# EAGLE design ardusb (EAGLE 6.4)
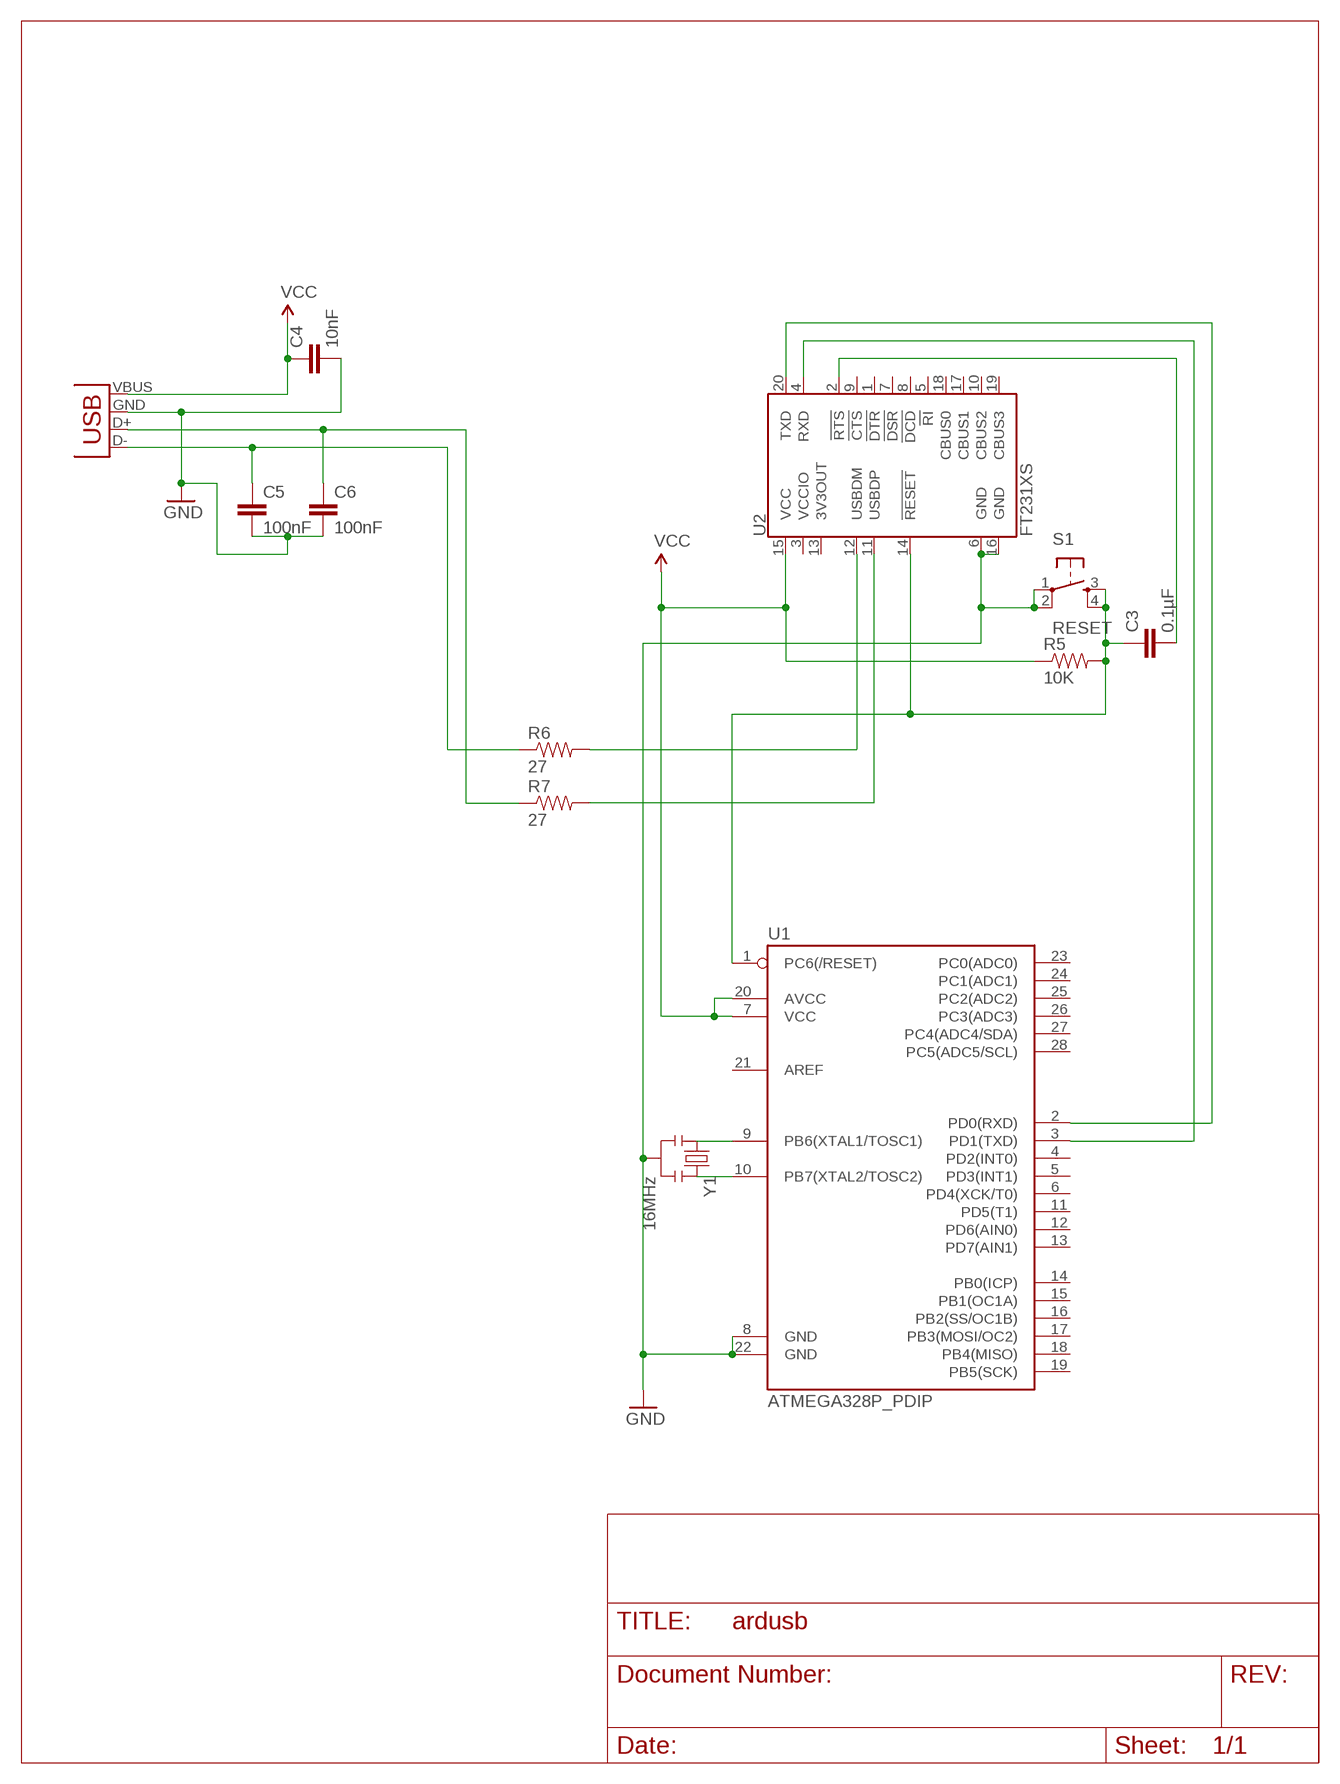
[diagram p0: schematic, sheet 1]

## Parts
C3  0.1µF  CAPPTH  [CAP-PTH-SMALL]
C4  10nF  CAPPTH  [CAP-PTH-SMALL]
C5  100nF  CAPPTH  [CAP-PTH-SMALL]
C6  100nF  CAPPTH  [CAP-PTH-SMALL]
JP1  USB-A-H  [USB-A-H]
R5  10K  RESISTORPTH-1W  [AXIAL-0.6]
R6  27  RESISTORPTH-1W  [AXIAL-0.6]
R7  27  RESISTORPTH-1W  [AXIAL-0.6]
S1  RESET  TAC_SWITCHPTH  [TACTILE-PTH]
U1  ATMEGA328P_PDIP  [DIL28-3]
U2  FT231XS  [SSOP20_L]
Y1  16MHz  RESONATORPTH  [RESONATOR-PTH]

## Nets
GND: C4.2 C5.2 C6.2 JP1.GND(VBUS) S1.1 S1.2 U1.8(GND) U1.22(GND) U2.6(GND) U2.16(GND) Y1.2
N$1: U1.9(PB6(XTAL1/TOSC1)) Y1.1
N$2: U1.10(PB7(XTAL2/TOSC2)) Y1.3
N$5: C3.1 R5.P$2 S1.3 S1.4 U1.1(PC6(/RESET)) U2.14(!RESET)
N$6: C3.2 U2.2(!RTS)
N$9: R6.P$2 U2.12(USBDM)
N$10: R7.P$2 U2.11(USBDP)
N$11: U1.3(PD1(TXD)) U2.4(RXD)
N$12: U1.2(PD0(RXD)) U2.20(TXD)
N$13: C6.1 JP1.D+(D-) R7.P$1
N$14: C5.1 JP1.D-(D+) R6.P$1
VCC: C4.1 JP1.VBUS(GND) R5.P$1 U1.7(VCC) U1.20(AVCC) U2.15(VCC)
Unconnected: U1.4(PD2(INT0)) U1.5(PD3(INT1)) U1.6(PD4(XCK/T0)) U1.11(PD5(T1)) U1.12(PD6(AIN0)) U1.13(PD7(AIN1)) U1.14(PB0(ICP)) U1.15(PB1(OC1A)) U1.16(PB2(SS/OC1B)) U1.17(PB3(MOSI/OC2)) U1.18(PB4(MISO)) U1.19(PB5(SCK)) U1.21(AREF) U1.23(PC0(ADC0)) U1.24(PC1(ADC1)) U1.25(PC2(ADC2)) U1.26(PC3(ADC3)) U1.27(PC4(ADC4/SDA)) U1.28(PC5(ADC5/SCL)) U2.1(!DTR) U2.3(VCCIO) U2.5(!RI) U2.7(!DSR) U2.8(!DCD) U2.9(!CTS) U2.10(CBUS2) U2.13(3V3OUT) U2.17(CBUS1) U2.18(CBUS0) U2.19(CBUS3)

## Library data of the parts
C3 C4 = SparkFun-Passives:CAP: Capacitor Standard 0603 ceramic capacitor, and 0.1" leaded capacitor.
C5 C6 = SparkFun-Capacitors:CAP: Capacitor Standard 0603 ceramic capacitor, and 0.1" leaded capacitor.
JP1 = SparkFun-Connectors:USB: USB Connectors USB-B-PTH is fully proven SKU : PRT-00139/CONN-08278 USB-miniB is fully proven SKU : PRT-00587 USB-A-PCB is untested. USB-A-H is throughly reviewed, but untested. Spark Fun Electronics SKU : PRT-00437 USB-B-SMT is throughly reviewed, but untested. Needs silkscreen touching up. USB-A-S has not been used/tested USB-MB-H has not been used/tested USB-MICROB has been used. CONN-09505
R5-R7 = SparkFun-Passives:RESISTOR: Resistor Basic schematic elements and footprints for 0603, 1206, and PTH resistors.
S1 = SparkFun-Electromechanical:TAC_SWITCH: Momentary Switch Button commonly used for reset or general input. Spark Fun Electronics SKU : COM-00097 SMT- SWCH-08247
U1 = SparkFun-DigitalIC:ATMEGA328P_PDIP: uC used in the Arduino 32kb flash, 1k EEPROM, 2k SRAM This is the through-hole version of this chip.
U2 = SparkFun-DigitalIC:FT231X: FTDI FT231X Full Speed USB to Full-handshake UART This USB2.0 Full Speed IC offers a compact bridge to full handshake UART interfaces. The device is a UART, capable of operating up to 3MBaud, with low power consumption (8mA). The FT231X includes the complete FT-X series feature set and enables USB to be added into a system design quickly and easily over a UART interface.
Y1 = SparkFun-FreqCtrl:RESONATOR: Resonator Small SMD resonator. Used, eg, on the Arduino Pro/ Pro Mini boards. 8MHz- XTAL-08895 16MHz- XTAL-08900

## Board
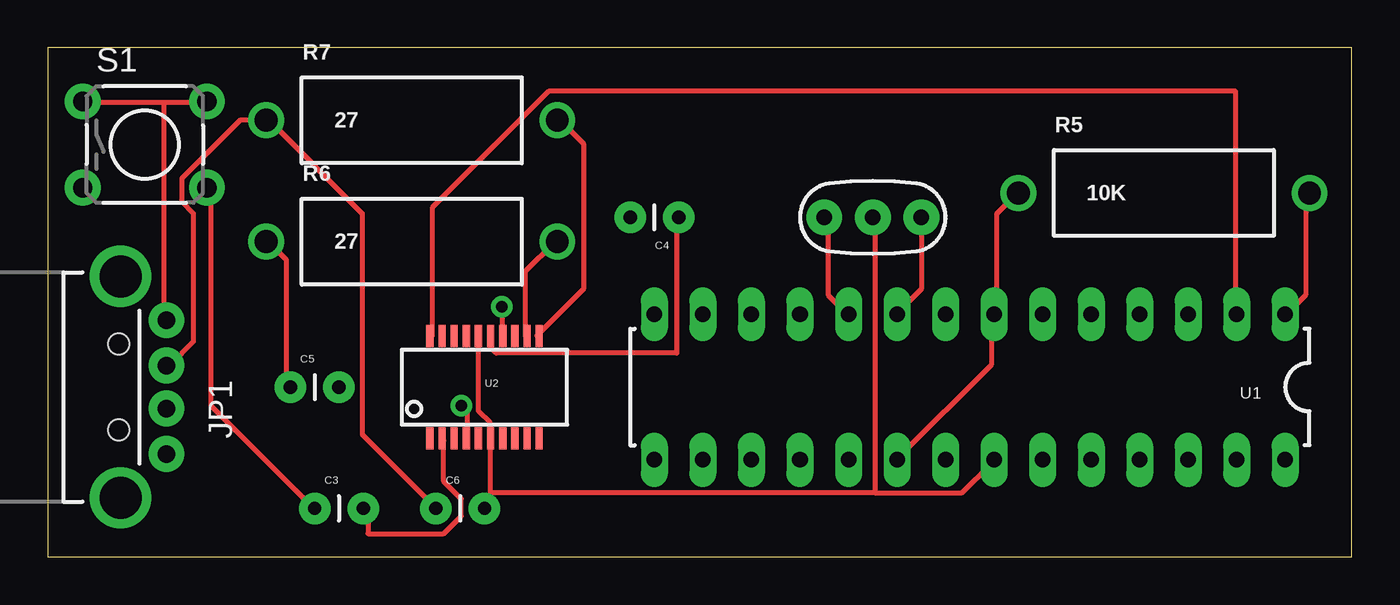
[diagram p1: board, top side]
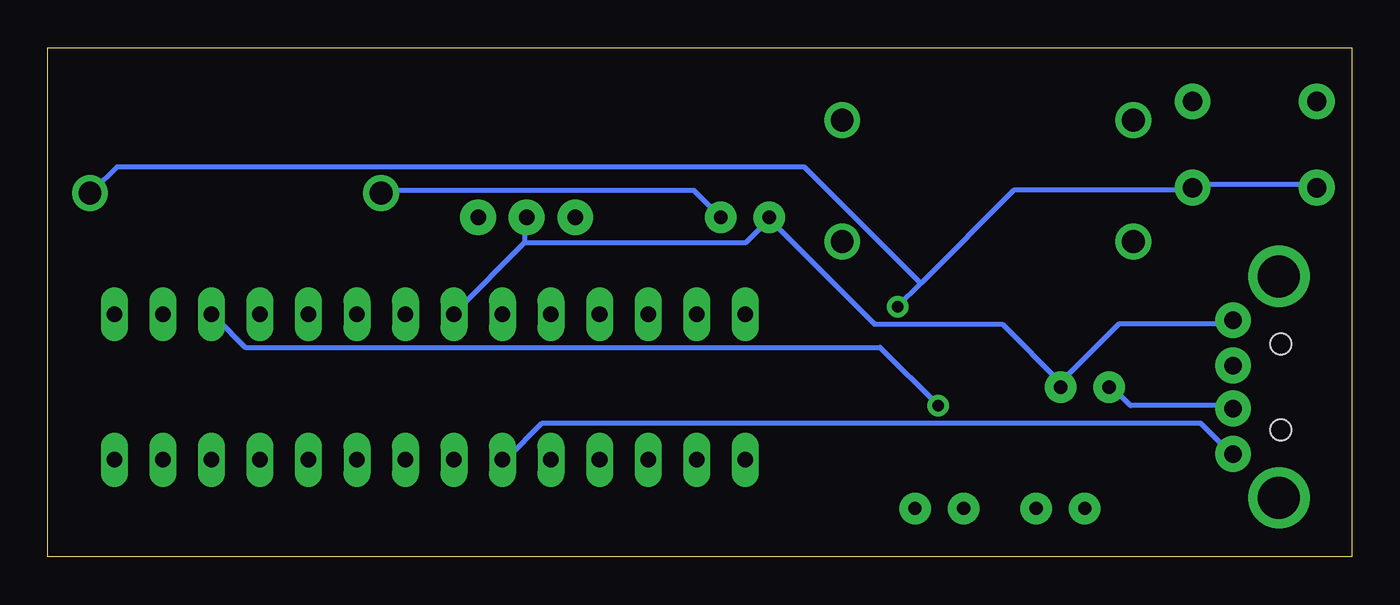
[diagram p2: board, bottom side, seen from below]

Size 68.25 x 26.66 mm. Coordinates in mm from the lower left corner, seen from the top.
Outline: 0,0 68.25,0 68.25,26.66 0,26.66 0,0
Copper layers (1*16): Top 0.035mm / dielectric 1.5mm / Bottom 0.035mm
Design rules "SparkFun": minimum track width 8mil, minimum drill 20mil, track to track 8mil, track to pad 8mil, pad to pad 8mil, via to via 8mil, smd to smd 8mil, copper to edge 10mil, drill to drill 8mil, minimum pad ring 12mil, minimum via ring 10mil, stop-mask expansion 4mil, vias tented up to drill 25mil, thermal gap 10mil

### Footprints (pad centres in the part's own frame; a part is rotated, then mirrored left to right if it is on the bottom)
CAP-PTH-SMALL = drill 0.7 pad 1.651: 1 0,0; 2 2.54,0
USB-A-H = drill 0.914 pad 1.88: D+ 2.4,1.127; D- 2.4,-1.127; GND 2.4,3.5; VBUS 2.4,-3.5 | drill 2.2: GND2 0,-5.8; GND3 0,5.8 | hole 1.1: -0.1,2.25; -0.1,-2.25
AXIAL-0.6 = drill 1.2 pad 1.88: P$1 -7.62,0; P$2 7.62,0
TACTILE-PTH = drill 1.016 pad 1.88: 1 -3.251,2.261; 2 3.251,2.261; 3 -3.251,-2.261; 4 3.251,-2.261
DIL28-3 = drill 0.813 long: 1 -16.51,-3.81; 2 -13.97,-3.81; 3 -11.43,-3.81; 4 -8.89,-3.81; 5 -6.35,-3.81; 6 -3.81,-3.81; 7 -1.27,-3.81; 8 1.27,-3.81; 9 3.81,-3.81; 10 6.35,-3.81; 11 8.89,-3.81; 12 11.43,-3.81; 13 13.97,-3.81; 14 16.51,-3.81; 15 16.51,3.81; 16 13.97,3.81; 17 11.43,3.81; 18 8.89,3.81; 19 6.35,3.81; 20 3.81,3.81; 21 1.27,3.81; 22 -1.27,3.81; 23 -3.81,3.81; 24 -6.35,3.81; 25 -8.89,3.81; 26 -11.43,3.81; 27 -13.97,3.81; 28 -16.51,3.81
SSOP20_L = smd 0.381 x 1.143: 1 -2.857,-2.68; 2 -2.223,-2.68; 3 -1.587,-2.68; 4 -0.953,-2.68; 5 -0.318,-2.68; 6 0.318,-2.68; 7 0.953,-2.68; 8 1.587,-2.68; 9 2.223,-2.68; 10 2.857,-2.68; 11 2.857,2.68; 12 2.223,2.68; 13 1.587,2.68; 14 0.953,2.68; 15 0.318,2.68; 16 -0.318,2.68; 17 -0.953,2.68; 18 -1.587,2.68; 19 -2.223,2.68; 20 -2.857,2.68
RESONATOR-PTH = drill 0.8 pad 1.88: 1 -2.54,0; 2 0,0; 3 2.54,0

### Placement (x,y rotation side)
C3  13.97,2.54 0 top
C4  33.02,17.78 180 top
C5  12.7,8.89 0 top
C6  20.32,2.54 0 top
JP1  3.81,8.89 0 top
R5  58.42,19.05 0 top
R6  19.05,16.51 0 top
R7  19.05,22.86 0 top
S1  5.08,21.59 0 top
U1  48.26,8.89 180 top
U2  22.86,8.89 0 top
Y1  43.18,17.78 180 top

### Tracks (layer width: path | path; a pad name or v marks a point on that pad's centre or on a via)
GND
  Top 0.254: 6.1,23.77 8.23,23.77 S1.2 | 6.1,23.77 1.83,23.77 S1.1 | 6.1,23.77 6.1,12.5 JP1.GND | 23.16,3.35 23.16,3.05 22.86,2.74 C6.2 23.16,3.35 | 23.16,3.35 23.16,6.1 U2.6 23.16,6.4 23.16,7.01 22.55,7.62 22.55,11.28 U2.16 | 43.28,3.35 47.85,3.35 49.38,4.88 U1.22 | 43.28,3.35 43.28,17.68 Y1.2 | 43.28,3.35 23.16,3.35
  Bottom 0.254: 15.24,9.14 12.19,12.19 6.4,12.19 JP1.GND | 43.28,16.46 46.94,12.8 U1.8 | 43.28,16.46 43.28,17.68 Y1.2 | 30.48,17.68 31.7,16.46 43.28,16.46 | 15.24,9.14 18.29,12.19 24.99,12.19 30.48,17.68 | 15.24,9.14 C5.2 | 30.48,17.68 C4.2
N$1
  Top 0.254: Y1.1 45.72,14.02 44.5,12.8 U1.9
N$2
  Top 0.254: U1.10 41.76,12.8 40.84,13.72 40.84,17.68 Y1.3
N$5  (via drill 0.61)
  Top 0.254: U1.1 64.92,12.8 65.84,13.72 65.84,18.9 R5.P$2 | v23.77,13.11 23.77,11.58 U2.14 | C3.1 13.72,2.74 8.53,7.92 8.53,19.2 S1.4
  Bottom 0.254: 22.55,14.33 17.68,19.2 8.53,19.2 S1.4 8.23,19.51 1.83,19.51 S1.3 | 22.55,14.33 v23.77,13.11 | 22.55,14.33 28.65,20.42 64.62,20.42 65.84,19.2 R5.P$2
N$6
  Top 0.254: U2.2 20.73,6.1 20.73,3.96 21.64,3.05 21.64,2.13 20.73,1.22 16.76,1.22 16.76,2.44 C3.2
N$9
  Top 0.254: U2.12 24.99,11.58 24.99,14.94 26.52,16.46 R6.P$2
N$10
  Top 0.254: U2.11 25.6,11.58 28.04,14.02 28.04,21.64 26.82,22.86 R7.P$2
N$11  (via drill 0.61)
  Top 0.254: v21.64,7.92 21.95,7.62 21.95,6.4 U2.4
  Bottom 0.254: v21.64,7.92 24.69,10.97 57.91,10.97 59.44,12.5 U1.3
N$12
  Top 0.254: U2.20 20.12,11.58 20.12,18.29 26.21,24.38 62.18,24.38 62.18,12.8 U1.2
N$13
  Top 0.254: C6.1 16.46,6.4 16.46,17.98 11.58,22.86 R7.P$1 10.06,22.86 7.01,19.81 7.01,18.59 7.62,17.98 7.62,11.28 6.4,10.06 JP1.D+
N$14
  Top 0.254: R6.P$1 11.58,16.46 12.5,15.54 12.5,9.14 C5.1
  Bottom 0.254: C5.1 12.5,8.84 11.58,7.92 6.4,7.92 JP1.D-
VCC
  Top 0.254: U2.15 23.16,11.28 23.16,10.97 23.47,10.67 32.92,10.67 32.92,17.68 C4.1 | U1.20 44.5,5.18 49.38,10.06 49.38,12.5 U1.7 49.68,12.8 49.68,17.98 50.6,18.9 R5.P$1
  Bottom 0.254: JP1.VBUS 6.4,5.49 7.92,7.01 42.37,7.01 44.2,5.18 U1.20 | C4.1 34.44,19.2 50.6,19.2 R5.P$1